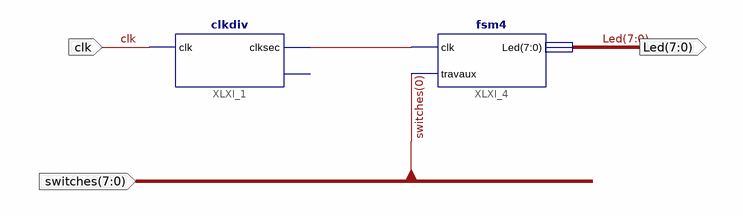
[diagram p0: schematic sheet 1]
// Xilinx ISE schematic toplevel.sch (spartan3e) as structural Verilog: 2 symbols, 3 ports
module toplevel (
  input  [7:0] switches,
  input  clk,
  output [7:0] Led
);

  wire XLXN_1;

  clkdiv XLXI_1 (.clk(clk), .clksec(XLXN_1));  // open: clk190
  fsm4 XLXI_4 (.clk(XLXN_1), .travaux(switches[0]), .Led(Led));
endmodule
